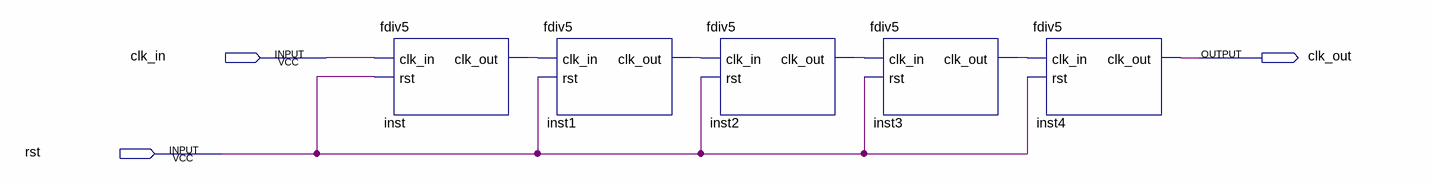
[diagram p0: schematic sheet]
// Quartus schematic fdiv25.bdf as structural Verilog: 5 symbols, 3 pins
module fdiv25 (
  input  clk_in,
  input  rst,
  output clk_out
);

  wire inst1_clk_out, inst2_clk_out, inst3_clk_out, inst_clk_out;

  fdiv5 inst (.clk_in(clk_in), .rst(rst), .clk_out(inst_clk_out));
  fdiv5 inst1 (.clk_in(inst_clk_out), .rst(rst), .clk_out(inst1_clk_out));
  fdiv5 inst2 (.clk_in(inst1_clk_out), .rst(rst), .clk_out(inst2_clk_out));
  fdiv5 inst3 (.clk_in(inst2_clk_out), .rst(rst), .clk_out(inst3_clk_out));
  fdiv5 inst4 (.clk_in(inst3_clk_out), .rst(rst), .clk_out(clk_out));
endmodule
